# EAGLE schematic bouton (EAGLE 7.6.0)
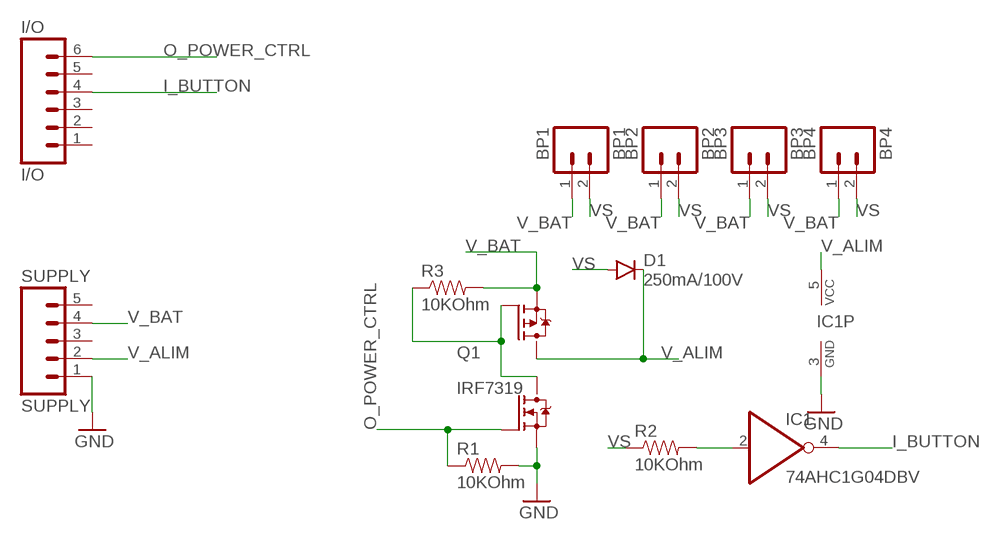
[diagram p0: schematic, sheet 1]

## Parts
BP1  BP1  M021X02_NO_SILK  [1X02_NO_SILK]
BP2  BP2  M021X02_NO_SILK  [1X02_NO_SILK]
BP3  BP3  M021X02_NO_SILK  [1X02_NO_SILK]
BP4  BP4  M021X02_NO_SILK  [1X02_NO_SILK]
D1  250mA/100V  DIODEBAS16  [SOD-323]
I/O  I/O  M06NO_SILK_FEMALE_PTH  [1X06_NO_SILK]
IC1  74AHC1G04DBV  [SOT23-5]
Q1  IRF7319  [SO08-IRF]
R1  10KOhm  RESISTOR0805-RES  [0805]
R2  10KOhm  RESISTOR0805-RES  [0805]
R3  10KOhm  RESISTOR0805-RES  [0805]
SUPPLY  SUPPLY  M05NO_SILK  [1X05_NO_SILK]

## Nets
GND: IC1.3(GND) Q1.1(N-S) R1.2 SUPPLY.1
I_BUTTON: I/O.4 IC1.4(O)
N$1: Q1.4(P-G) Q1.7(N-D) Q1.8(N-D) R3.1
N$2: IC1.2(I) R2.2
O_POWER_CTRL: I/O.6 Q1.2(N-G) R1.1
V_ALIM [SUPPLY]: D1.C IC1.5(VCC) Q1.5(P-D) Q1.6(P-D) SUPPLY.2
V_BAT [SUPPLY]: BP1.1 BP2.1 BP3.1 BP4.1 Q1.3(P-S) R3.2 SUPPLY.4
VS: BP1.2 BP2.2 BP3.2 BP4.2 D1.A R2.1
Unconnected: I/O.1 I/O.2 I/O.3 I/O.5 SUPPLY.3 SUPPLY.5

## Library data of the parts
BP1-BP4 = SparkFun-Connectors:M02: Standard 2-pin 0.1" header. Use with - straight break away headers ( PRT-00116) - right angle break away headers (PRT-00553) - swiss pins (PRT-00743) - machine pins (PRT-00117) - female headers (PRT-00115) Molex polarized connector foot print use with: PRT-08233 with associated crimp pins and housings. 2.54_SCREWTERM for use with PRT-10571. 3.5mm Screw Terminal footprints for PRT-08084 5mm Screw Terminal footprints for use with PRT-08432
D1 = SparkFun-DiscreteSemi:DIODE: Diode These are standard reverse protection diodes and small signal diodes. SMA package can handle up to about 1A. SOD-323 can handle about 200mA. What the SOD-323 package when ordering, there are some mfgs out there that are 5-pin packages.; PROD_ID: DIO-09646
I/O = SparkFun-Connectors:M06: Header 6 Standard 6-pin 0.1" header. Use with straight break away headers (SKU : PRT-00116), right angle break away headers (PRT-00553), swiss pins (PRT-00743), machine pins (PRT-00117), and female headers (PRT-00115). Molex polarized connector foot print use with SKU : PRT-08094 with associated crimp pins and housings. NOTES ON THE VARIANTS LOCK and LOCK_LONGPADS... This footprint was designed to help hold the alignment of a through-hole component (i.e. 6-pin header) while soldering it into place. You may notice that each hole has been shifted either up or down by 0.005 of an inch from it's more standard position (which is a perfectly straight line). This slight alteration caused the pins (the squares in the middle) to touch the edges of the holes. Because they are alternating, it causes a "brace" to hold the component in place. 0.005 has proven to be the perfect amount of "off-center" position when using our standard breakaway headers. Although looks a little odd when you look at the bare footprint, once you have a header in there, the alteration is very hard to notice. Also,if you push a header all the way into place, it is covered up entirely on the bottom side. This idea of altering the position of holes to aid alignment will be further integrated into the Sparkfun Library for other footprints. It can help hold any component with 3 or more connection pins.; PROD_ID: CONN-08437
IC1 = 74xx-little-de:74*1G04: INVERTER Gate
Q1 = lio:IRF7319: Complimentary Half Bridge HEXFET Power MOSFET Source: http://www.irf.com/product-info/datasheets/data/irf7319.pdf
R1-R3 = SparkFun-Resistors:RESISTOR: Resistor Basic schematic elements and footprints for 0603, 1206, and PTH resistors.
SUPPLY = SparkFun-Connectors:M05: Header 5 Standard 5-pin 0.1" header. Use with straight break away headers (SKU : PRT-00116), right angle break away headers (PRT-00553), swiss pins (PRT-00743), machine pins (PRT-00117), and female headers (PRT-00115). Molex polarized connector foot print use with SKU : PRT-08230 with associated crimp pins and housings.

## Net classes
0 default: width 0.3 mm
1 GND: width 0.5 mm, clearance 0.5 mm
2 SUPPLY: width 0.5 mm, clearance 0.003 mm